# Altium project COMECA-TestBoard.PrjPcb
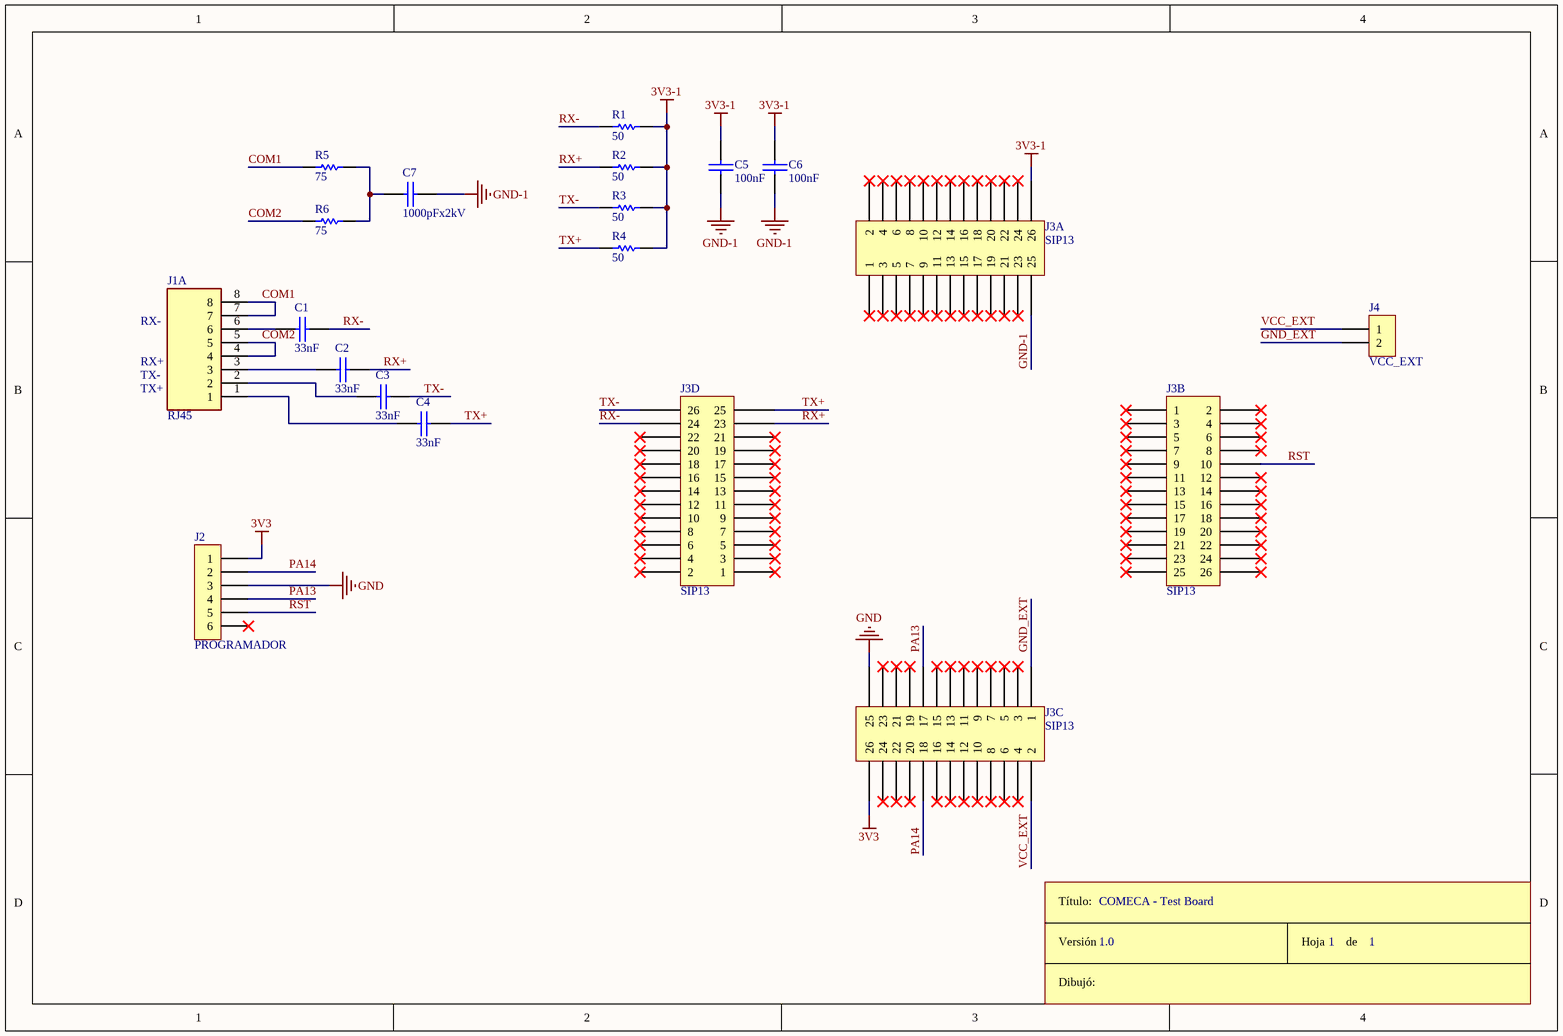
[diagram p0: COMECA_TestSCH.SchDoc]
1 sheet, 21 parts. Net scope: global (net labels, ports and power ports of the same name join across sheets).
Board file: COMECA-TestPCB.PcbDoc

## Sheet COMECA_TestSCH.SchDoc
size A4; SheetNumber: 1; SheetTotal: 1

### Parts
C1  33nF  [CAP100]
C2  33nF  [CAP100]
C3  33nF  [CAP100]
C4  33nF  [CAP100]
C5  100nF  [CAP100]
C6  100nF  [CAP100]
C7  1000pFx2kV  [CAP100]
J1A  RJ45  [CUI_CRJ032-1-TH]
J2  PROGRAMADOR  [SIP6]
J3A  SIP13  [SIP13*2 - HDR]
J3B  SIP13  [SIP13*2 - HDR]
J3C  SIP13  [SIP13*2 - HDR]
J3D  SIP13  [SIP13*2 - HDR]
J4  VCC_EXT  [SIP2]
R1  50  [RES400]
R2  50  [RES400]
R3  50  [RES400]
R4  50  [RES400]
R5  75  [RES400]
R6  75  [RES400]
ROT1  Rótulo  (value not drawn)  (graphical)

### Nets
3V3: J2.1 J3C.26
3V3-1: C5.1 C6.1 J3A.26 R1.2 R2.2 R3.2 R4.2
GND: J2.3 J3C.25
GND-1: C5.2 C6.2 C7.2 J3A.25
COM1: J1A.7 J1A.8 R5.2
COM2: J1A.4 J1A.5 R6.1
GND_EXT: J3C.1 J4.2
PA13: J2.4 J3C.17
PA14: J2.2 J3C.18
RST: J2.5 J3B.10
RX+: C2.2 J3D.23 R2.1
RX-: C1.2 J3D.24 R1.1
TX+: C4.2 J3D.25 R4.1
TX-: C3.2 J3D.26 R3.1
VCC_EXT: J3C.2 J4.1
NetC1_1: C1.1 J1A.6
NetC2_1: C2.1 J1A.3
NetC3_1: C3.1 J1A.2
NetC4_1: C4.1 J1A.1
NetC7_1: C7.1 R5.1 R6.2

Not connected (* = marked no-connect by the designer): J2 6*; J3A 1* 2* 3* 4* 5* 6* 7* 8* 9* 10* 11* 12* 13* 14* 15* 16* 17* 18* 19* 20* 21* 22* 23* 24*; J3B 1* 2* 3* 4* 5* 6* 7* 8* 9* 11* 12* 13* 14* 15* 16* 17* 18* 19* 20* 21* 22* 23* 24* 25* 26*; J3C 3* 4* 5* 6* 7* 8* 9* 10* 11* 12* 13* 14* 15* 16* 19* 20* 21* 22* 23* 24*; J3D 1* 2* 3* 4* 5* 6* 7* 8* 9* 10* 11* 12* 13* 14* 15* 16* 17* 18* 19* 20* 21* 22*

### Notes on the sheet
- RX-
- RX+
- TX-
- TX+
- COMECA - Test Board
- 1.0
- 1
- (in symbol Rótulo) Título:; Versión; Hoja       de; Dibujó:

### Library data of the parts
C1-C7 = CAP
J1A = CRJ032-1-TH: 8P8C, Single Port, Horizontal, Unshielded, No LED, Through Hole, RJ45 Modular Connector; MF: CUI Devices; MP: CRJ032-1-TH; SnapEDA_Link: https://www.snapeda.com/parts/CRJ032-1-TH/CUI%20Devices/view-part/6363031/?ref=snap; Availability: In Stock; CUI_purchase_URL: https://www.cuidevices.com/product/interconnect/connectors/modular-connectors/rj45-connectors/crj032-1-th?utm_source=snapeda.com&utm_medium=referral&utm_campaign=snapedaBOM; Check_prices: https://www.snapeda.com/parts/CRJ032-1-TH/CUI%20Devices/view-part/6363031/?ref=eda; Value: *; Purchase-URL: https://pricing.snapeda.com/search/part/CRJ032-1-TH/?ref=eda; Package: None; Price: None
J2 = CON6
J3A J3B J3C J3D = CON13*2
J4 = CON2
R1-R6 = RES